# Altium schematic sheet 24秒倒计时.SchDoc
size A4
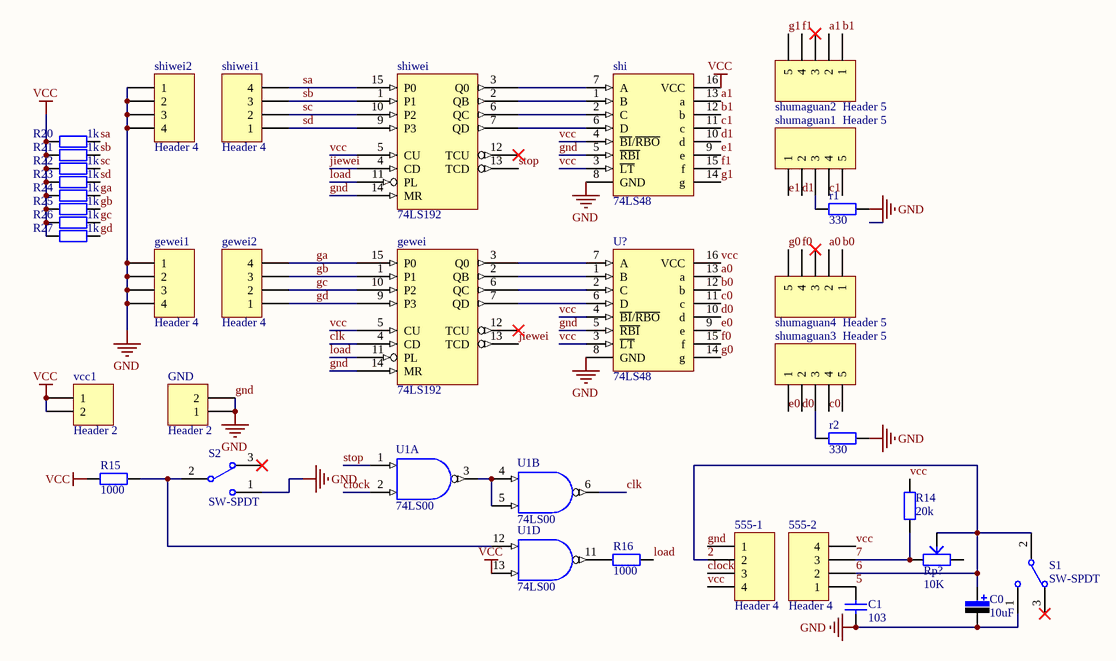
[diagram p0: 24秒倒计时.SchDoc]

## Parts
555-1  Header 4  [HDR1X4]
555-2  Header 4  [HDR1X4]
C0  value 10uF  [CAP_4*7mm]  (hidden comment: Cap Pol)
C1  value 103  [CAP]  (hidden comment: Cap)
gewei  74LS192  [DIP-16]
gewei1  Header 4  [HDR1X4]
gewei2  Header 4  [HDR1X4]
GND  Header 2  [HDR1X2]
r1  value 330  [AXIAL-0.3]  (hidden comment: Res1)
r2  value 330  [AXIAL-0.3]  (hidden comment: Res1)
R14  value 20k  [AXIAL-0.3]  (hidden comment: Res1)
R15  value 1000  [AXIAL-0.3]  (hidden comment: Res1)
R16  value 1000  [AXIAL-0.3]  (hidden comment: Res1)
R20  value 1k  [AXIAL-0.3]  (hidden comment: Res1)
R21  value 1k  [AXIAL-0.3]  (hidden comment: Res1)
R22  value 1k  [AXIAL-0.3]  (hidden comment: Res1)
R23  value 1k  [AXIAL-0.3]  (hidden comment: Res1)
R24  value 1k  [AXIAL-0.3]  (hidden comment: Res1)
R25  value 1k  [AXIAL-0.3]  (hidden comment: Res1)
R26  value 1k  [AXIAL-0.3]  (hidden comment: Res1)
R27  value 1k  [AXIAL-0.3]  (hidden comment: Res1)
Rp?  value 10K  [RES_ADJ]  (hidden comment: Res_ADJ)
S1  SW-SPDT  [SWITCH_A1]
S2  SW-SPDT  [SWITCH_A1]
shi  74LS48  [DIP-16]
shiwei  74LS192  [DIP-16]
shiwei1  Header 4  [HDR1X4]
shiwei2  Header 4  [HDR1X4]
shumaguan1  Header 5  [HDR1X5]
shumaguan2  Header 5  [HDR1X5]
shumaguan3  Header 5  [HDR1X5]
shumaguan4  Header 5  [HDR1X5]
U1  74LS00  [DIP-14]  (parts A,B,D of 4)
U?  74LS48  [DIP-16]
vcc1  Header 2  [HDR1X2]

## Nets
gnd: 555-1.1 C0.2 C1.1 gewei.8(GND) gewei.14(MR) gewei1.1 gewei1.2 gewei1.3 gewei1.4 GND.1 GND.2 r1.1 r2.2 S1.1 S2.1 shi.5(~{RBI}) shi.8(GND) shiwei.8(GND) shiwei.14(MR) shiwei2.1 shiwei2.2 shiwei2.3 shiwei2.4 U1.7(GND) U?.5(~{RBI}) U?.8(GND)
vcc: 555-1.4 555-2.4 gewei.5(CU) gewei.16(VCC) R14.2 R15.2 R20.1 R21.1 R22.1 R23.1 R24.1 R25.1 R26.1 R27.1 shi.3(~{LT}) shi.4(~{BI}/~{RBO}) shi.16(VCC) shiwei.5(CU) shiwei.16(VCC) U1.13(B) U1.14(VCC) U?.3(~{LT}) U?.4(~{BI}/~{RBO}) U?.16(VCC) vcc1.1 vcc1.2
2: 555-1.2 555-2.2 C0.1 Rp?.2 S1.2  [also labelled 6]
5: 555-2.1 C1.2
7: 555-2.3 R14.1 Rp?.3
a0: shumaguan4.2 U?.13(a)
a1: shi.13(a) shumaguan2.2
b0: shumaguan4.1 U?.12(b)
b1: shi.12(b) shumaguan2.1
c0: shumaguan3.4 U?.11(c)
c1: shi.11(c) shumaguan1.4
clk: gewei.4(CD) U1.6(Y)
clock: 555-1.3 U1.2(B)
d0: shumaguan3.2 U?.10(d)
d1: shi.10(d) shumaguan1.2
e0: shumaguan3.1 U?.9(e)
e1: shi.9(e) shumaguan1.1
f0: shumaguan4.4 U?.15(f)
f1: shi.15(f) shumaguan2.4
g0: shumaguan4.5 U?.14(g)
g1: shi.14(g) shumaguan2.5
ga: gewei.15(P0) gewei2.4 R24.2
gb: gewei.1(P1) gewei2.3 R25.2
gc: gewei.10(P2) gewei2.2 R26.2
gd: gewei.9(P3) gewei2.1 R27.2
jiewei: gewei.13(TCD) shiwei.4(CD)
load: gewei.11(PL) R16.1 shiwei.11(PL)
sa: R20.2 shiwei.15(P0) shiwei1.4
sb: R21.2 shiwei.1(P1) shiwei1.3
sc: R22.2 shiwei.10(P2) shiwei1.2
sd: R23.2 shiwei.9(P3) shiwei1.1
stop: shiwei.13(TCD) U1.1(A)
Netgewei_2: gewei.2(QB) U?.1(B)
Netgewei_3: gewei.3(Q0) U?.7(A)
Netgewei_6: gewei.6(QC) U?.2(C)
Netgewei_7: gewei.7(QD) U?.6(D)
Netr1_2: r1.2 shumaguan1.3
Netr2_1: r2.1 shumaguan3.3
NetR15_1: R15.1 S2.2 U1.12(A)
NetR16_2: R16.2 U1.11(Y)
Netshi_1: shi.1(B) shiwei.2(QB)
Netshi_2: shi.2(C) shiwei.6(QC)
Netshi_6: shi.6(D) shiwei.7(QD)
Netshi_7: shi.7(A) shiwei.3(Q0)
NetU1_3: U1.3(Y) U1.4(A) U1.5(B)

Not connected (* = marked no-connect by the designer): gewei 12(TCU)*; Rp? 1; S1 3*; S2 3*; shiwei 12(TCU)*; shumaguan1 5; shumaguan2 3*; shumaguan3 5; shumaguan4 3*

## Library data of the parts
555-1 555-2 gewei1 gewei2 shiwei1 shiwei2 = Header 4: Header, 4-Pin; LatestRevisionDate: 17-Jul-2002; LatestRevisionNote: Re-released for DXP Platform.; Publisher: Altium Limited
C0 = Cap Pol: 极性电解电容; Vol: 16V; Published: 8-Jun-2000; LatestRevisionDate: 17-Jul-2002; LatestRevisionNote: Re-released for DXP Platform.; PackageReference: RB7.6-15; Publisher: Altium Limited
C1 = Cap: 无极性电容; Published: 8-Jun-2000; LatestRevisionDate: 17-Jul-2002; LatestRevisionNote: Re-released for DXP Platform.; PackageReference: RAD-0.3; Publisher: Altium Limited
GND vcc1 = Header 2: Header, 2-Pin; LatestRevisionDate: 17-Jul-2002; LatestRevisionNote: Re-released for DXP Platform.; Publisher: Altium Limited
r1 r2 = Res1_1: 贴片电阻; Published: 8-Jun-2000; LatestRevisionDate: 17-Jul-2002; LatestRevisionNote: Re-released for DXP Platform.; PackageReference: AXIAL-0.4; Publisher: Altium Limited
R14-R16 R20-R27 = Res1: 贴片电阻; Published: 8-Jun-2000; LatestRevisionDate: 17-Jul-2002; LatestRevisionNote: Re-released for DXP Platform.; PackageReference: AXIAL-0.4; Publisher: Altium Limited
Rp? = Res_ADJ: Set Position: 0.5; Published: 8-Jun-2000; LatestRevisionDate: 17-Jul-2002; LatestRevisionNote: Re-released for DXP Platform.; PackageReference: AXIAL-0.6; Publisher: Altium Limited; PackageDescription: Axial Device, Thru-Hole; 2 Leads; 0.6 in Pin Spacing
S1 S2 = SW-SPDT: 开关; Published: 24-Mar-1999; LatestRevisionDate: 17-Dec-2003; LatestRevisionNote: Schematic revised, PCB Footprint replaced.; DatasheetDocument: 05-Dec-2000; PackageReference: TL36WW15050; Publisher: Altium Limited; ComponentLink1Description: Manufacturer Link; ComponentLink1URL: http://www.apem.com
shi U? = 74LS48: BCD-to-Seven-Segment Decoder/Driver
shumaguan1-shumaguan4 = Header 5: Header, 5-Pin; LatestRevisionDate: 17-Jul-2002; LatestRevisionNote: Re-released for DXP Platform.; Publisher: Altium Limited
U1 = 74LS00: Quad 2-Input Positive-NAND Gate